# Altium schematic sheet CellMonitor1.SchDoc
size A2
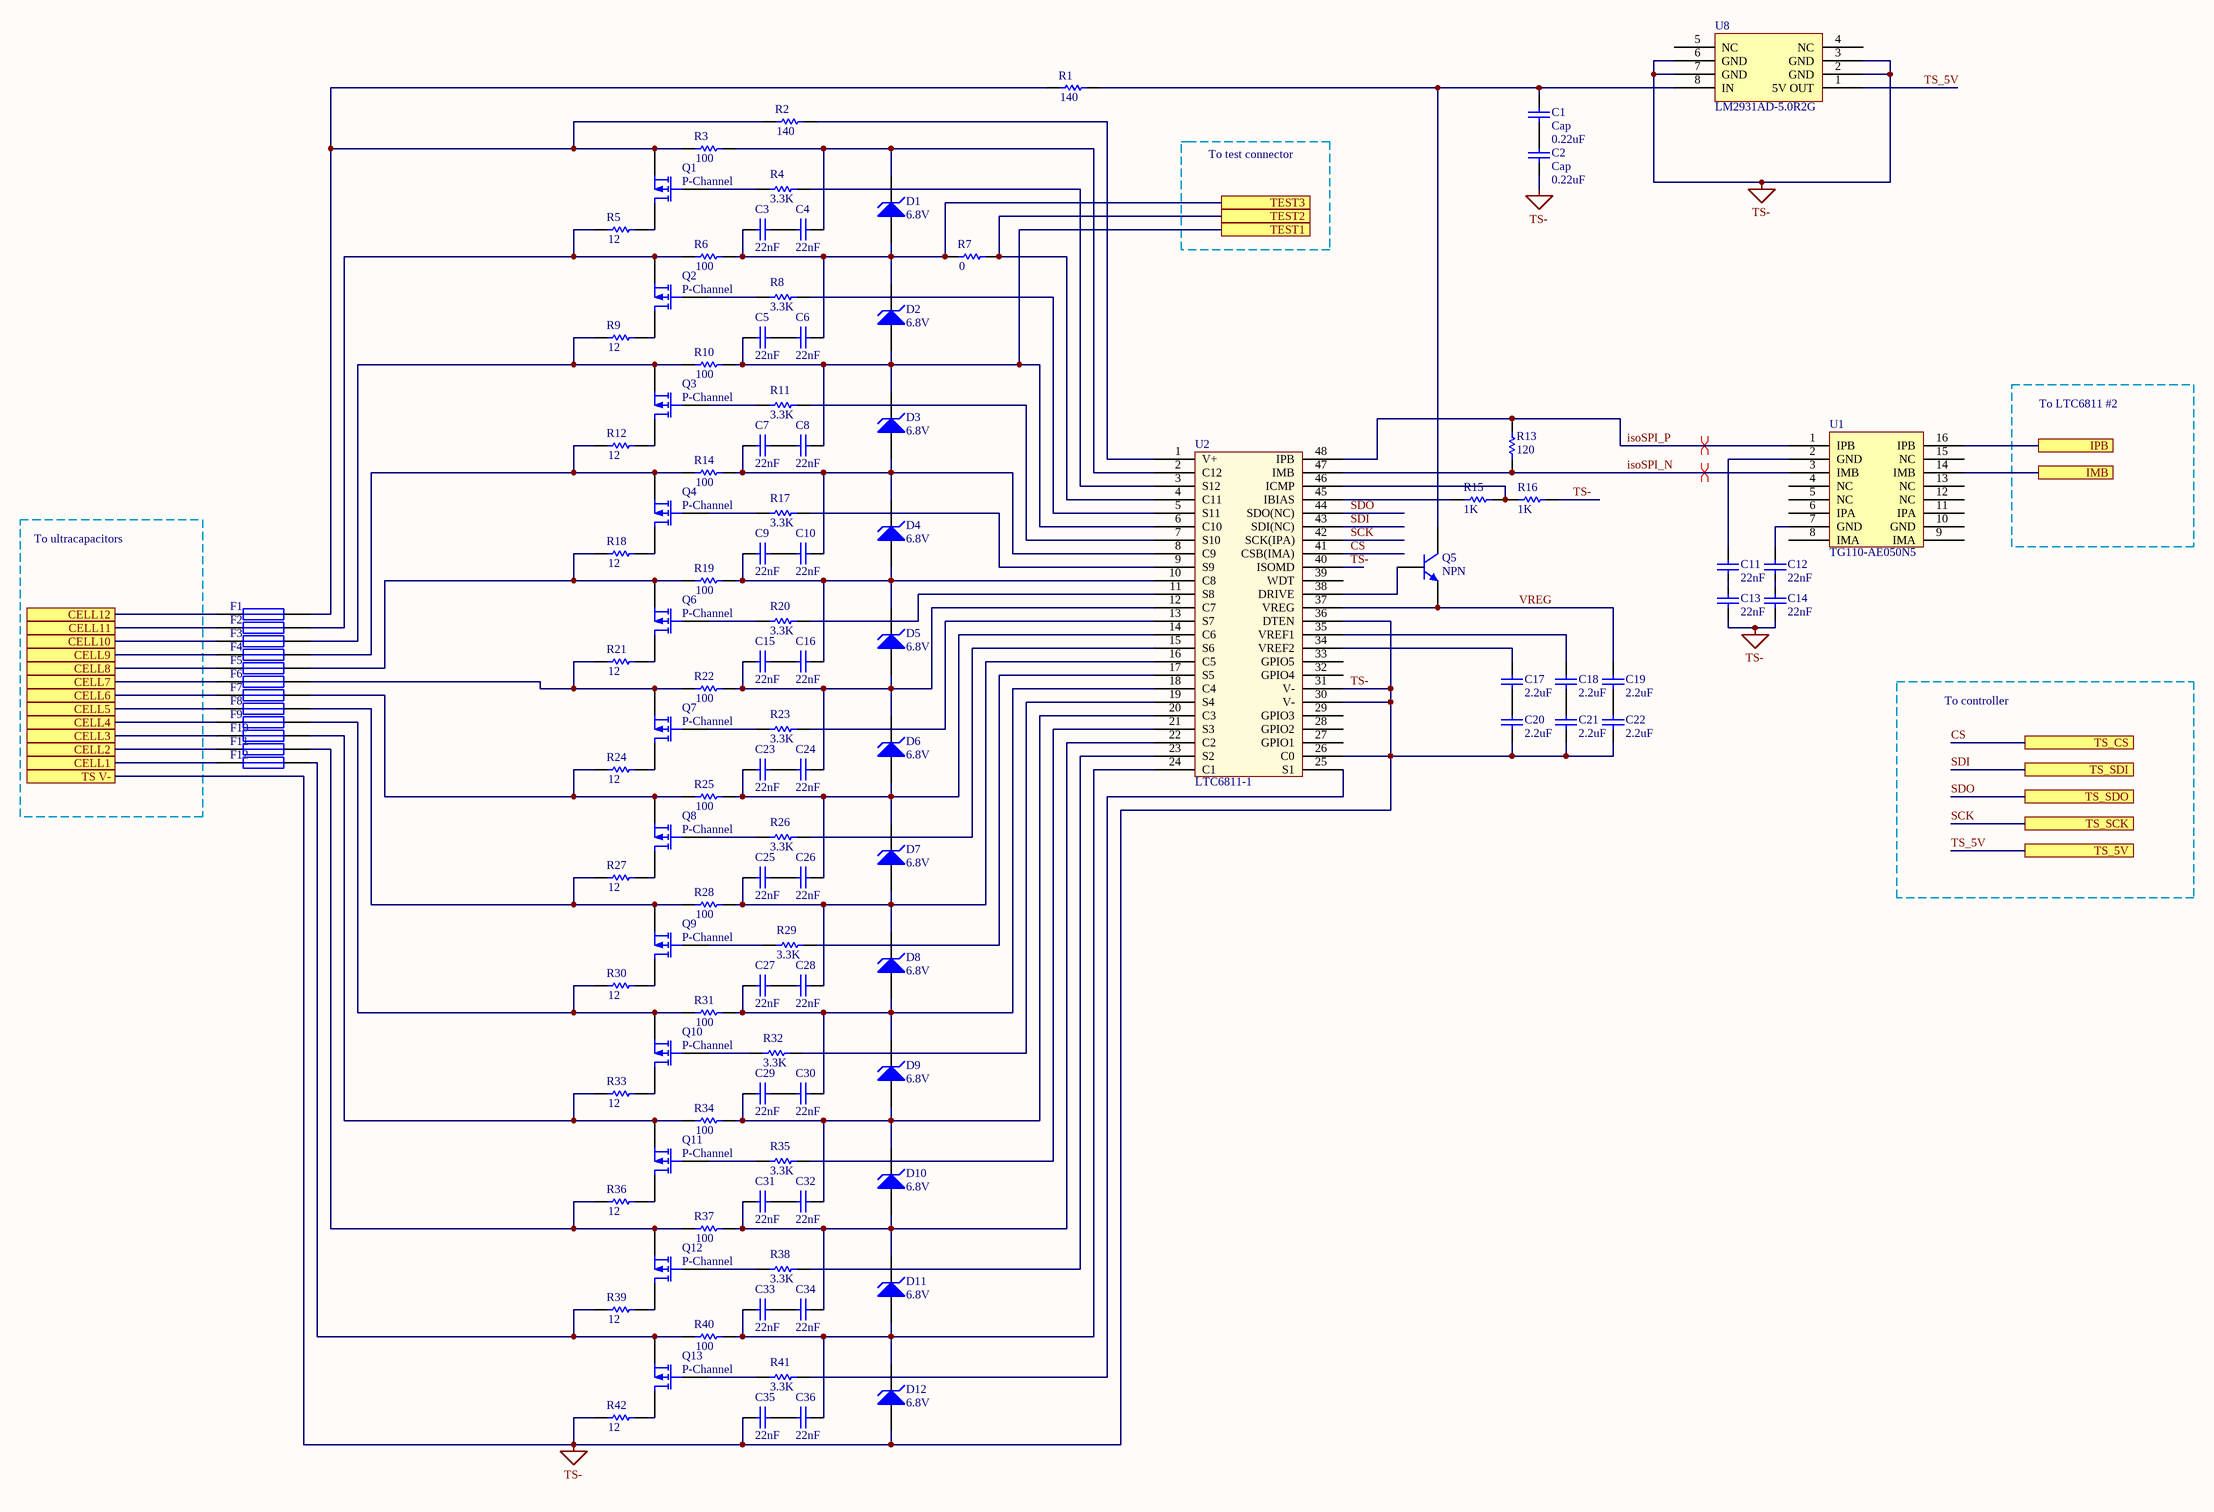
[diagram p0: CellMonitor1.SchDoc]

## Parts
C1  Cap  value 0.22uF  [0603 IMPERIAL]
C2  Cap  value 0.22uF  [0603 IMPERIAL]
C3  value 22nF  [0603 IMPERIAL]  (hidden comment: Cap)
C4  value 22nF  [0603 IMPERIAL]  (hidden comment: Cap)
C5  value 22nF  [0603 IMPERIAL]  (hidden comment: Cap)
C6  value 22nF  [0603 IMPERIAL]  (hidden comment: Cap)
C7  value 22nF  [0603 IMPERIAL]  (hidden comment: Cap)
C8  value 22nF  [0603 IMPERIAL]  (hidden comment: Cap)
C9  value 22nF  [0603 IMPERIAL]  (hidden comment: Cap)
C10  value 22nF  [0603 IMPERIAL]  (hidden comment: Cap)
C11  value 22nF  [0603 IMPERIAL]  (hidden comment: Cap)
C12  value 22nF  [0603 IMPERIAL]  (hidden comment: Cap)
C13  value 22nF  [0603 IMPERIAL]  (hidden comment: Cap)
C14  value 22nF  [0603 IMPERIAL]  (hidden comment: Cap)
C15  value 22nF  [0603 IMPERIAL]  (hidden comment: Cap)
C16  value 22nF  [0603 IMPERIAL]  (hidden comment: Cap)
C17  value 2.2uF  [0603 IMPERIAL]  (hidden comment: Cap)
C18  value 2.2uF  [0603 IMPERIAL]  (hidden comment: Cap)
C19  value 2.2uF  [0603 IMPERIAL]  (hidden comment: Cap)
C20  value 2.2uF  [0603 IMPERIAL]  (hidden comment: Cap)
C21  value 2.2uF  [0603 IMPERIAL]  (hidden comment: Cap)
C22  value 2.2uF  [0603 IMPERIAL]  (hidden comment: Cap)
C23  value 22nF  [0603 IMPERIAL]  (hidden comment: Cap)
C24  value 22nF  [0603 IMPERIAL]  (hidden comment: Cap)
C25  value 22nF  [0603 IMPERIAL]  (hidden comment: Cap)
C26  value 22nF  [0603 IMPERIAL]  (hidden comment: Cap)
C27  value 22nF  [0603 IMPERIAL]  (hidden comment: Cap)
C28  value 22nF  [0603 IMPERIAL]  (hidden comment: Cap)
C29  value 22nF  [0603 IMPERIAL]  (hidden comment: Cap)
C30  value 22nF  [0603 IMPERIAL]  (hidden comment: Cap)
C31  value 22nF  [0603 IMPERIAL]  (hidden comment: Cap)
C32  value 22nF  [0603 IMPERIAL]  (hidden comment: Cap)
C33  value 22nF  [0603 IMPERIAL]  (hidden comment: Cap)
C34  value 22nF  [0603 IMPERIAL]  (hidden comment: Cap)
C35  value 22nF  [0603 IMPERIAL]  (hidden comment: Cap)
C36  value 22nF  [0603 IMPERIAL]  (hidden comment: Cap)
D1  6.8V  [SOD-323]
D2  6.8V  [SOD-323]
D3  6.8V  [SOD-323]
D4  6.8V  [SOD-323]
D5  6.8V  [SOD-323]
D6  6.8V  [SOD-323]
D7  6.8V  [SOD-323]
D8  6.8V  [SOD-323]
D9  6.8V  [SOD-323]
D10  6.8V  [SOD-323]
D11  6.8V  [SOD-323]
D12  6.8V  [SOD-323]
F1  0451.500NRL  [0451.500NRL]  (value not drawn)
F2  0451.500NRL  [0451.500NRL]  (value not drawn)
F3  0451.500NRL  [0451.500NRL]  (value not drawn)
F4  0451.500NRL  [0451.500NRL]  (value not drawn)
F5  0451.500NRL  [0451.500NRL]  (value not drawn)
F6  0451.500NRL  [0451.500NRL]  (value not drawn)
F7  0451.500NRL  [0451.500NRL]  (value not drawn)
F8  0451.500NRL  [0451.500NRL]  (value not drawn)
F9  0451.500NRL  [0451.500NRL]  (value not drawn)
F10  0451.500NRL  [0451.500NRL]  (value not drawn)
F11  0451.500NRL  [0451.500NRL]  (value not drawn)
F12  0451.500NRL  [0451.500NRL]  (value not drawn)
Q1  P-Channel  [SOT23F]
Q2  P-Channel  [SOT23F]
Q3  P-Channel  [SOT23F]
Q4  P-Channel  [SOT23F]
Q5  NPN  [SOT223_N]
Q6  P-Channel  [SOT23F]
Q7  P-Channel  [SOT23F]
Q8  P-Channel  [SOT23F]
Q9  P-Channel  [SOT23F]
Q10  P-Channel  [SOT23F]
Q11  P-Channel  [SOT23F]
Q12  P-Channel  [SOT23F]
Q13  P-Channel  [SOT23F]
R1  value 140  [0603 IMPERIAL]  (hidden comment: Res1)
R2  value 140  [0603 IMPERIAL]  (hidden comment: Res1)
R3  value 100  [0603 IMPERIAL]  (hidden comment: Res1)
R4  value 3.3K  [0603 IMPERIAL]  (hidden comment: Res1)
R5  value 12  [2512 IMPERIAL]  (hidden comment: Res1)
R6  value 100  [0603 IMPERIAL]  (hidden comment: Res1)
R7  value 0  [0603 IMPERIAL]  (hidden comment: Res1)
R8  value 3.3K  [0603 IMPERIAL]  (hidden comment: Res1)
R9  value 12  [2512 IMPERIAL]  (hidden comment: Res1)
R10  value 100  [0603 IMPERIAL]  (hidden comment: Res1)
R11  value 3.3K  [0603 IMPERIAL]  (hidden comment: Res1)
R12  value 12  [2512 IMPERIAL]  (hidden comment: Res1)
R13  120  [0603 IMPERIAL]
R14  value 100  [0603 IMPERIAL]  (hidden comment: Res1)
R15  1K  [0603 IMPERIAL]
R16  1K  [0603 IMPERIAL]
R17  value 3.3K  [0603 IMPERIAL]  (hidden comment: Res1)
R18  value 12  [2512 IMPERIAL]  (hidden comment: Res1)
R19  value 100  [0603 IMPERIAL]  (hidden comment: Res1)
R20  value 3.3K  [0603 IMPERIAL]  (hidden comment: Res1)
R21  value 12  [2512 IMPERIAL]  (hidden comment: Res1)
R22  value 100  [0603 IMPERIAL]  (hidden comment: Res1)
R23  value 3.3K  [0603 IMPERIAL]  (hidden comment: Res1)
R24  value 12  [2512 IMPERIAL]  (hidden comment: Res1)
R25  value 100  [0603 IMPERIAL]  (hidden comment: Res1)
R26  value 3.3K  [0603 IMPERIAL]  (hidden comment: Res1)
R27  value 12  [2512 IMPERIAL]  (hidden comment: Res1)
R28  value 100  [0603 IMPERIAL]  (hidden comment: Res1)
R29  value 3.3K  [0603 IMPERIAL]  (hidden comment: Res1)
R30  value 12  [2512 IMPERIAL]  (hidden comment: Res1)
R31  value 100  [0603 IMPERIAL]  (hidden comment: Res1)
R32  value 3.3K  [0603 IMPERIAL]  (hidden comment: Res1)
R33  value 12  [2512 IMPERIAL]  (hidden comment: Res1)
R34  value 100  [0603 IMPERIAL]  (hidden comment: Res1)
R35  value 3.3K  [0603 IMPERIAL]  (hidden comment: Res1)
R36  value 12  [2512 IMPERIAL]  (hidden comment: Res1)
R37  value 100  [0603 IMPERIAL]  (hidden comment: Res1)
R38  value 3.3K  [0603 IMPERIAL]  (hidden comment: Res1)
R39  value 12  [2512 IMPERIAL]  (hidden comment: Res1)
R40  value 100  [0603 IMPERIAL]  (hidden comment: Res1)
R41  value 3.3K  [0603 IMPERIAL]  (hidden comment: Res1)
R42  value 12  [2512 IMPERIAL]  (hidden comment: Res1)
U1  TG110-AE050N5  [Halo N5]
U2  LTC6811-1  [SSOP-48]
U8  LM2931AD-5.0R2G  [8-SOIC]

## Ports
CELL1, CELL2, CELL3, CELL4, CELL5, CELL6, CELL7, CELL8, CELL9, CELL10, CELL11, CELL12, IMB, IPB, TEST1, TEST2, TEST3, TS V-, TS_5V, TS_CS, TS_SCK, TS_SDI, TS_SDO

## Nets
TS-: C2.2 C13.2 C14.2 C20.2 C21.2 C22.2 C35.2 D12.1(A) R16.2 R42.1 U2.26(C0) U2.30(V-) U2.31(V-) U2.36(DTEN) U2.40(ISOMD) U8.2(GND) U8.3(GND) U8.6(GND) U8.7(GND) ; port TS V-
CELL1: F12.1 ; port CELL1
CELL2: F11.1 ; port CELL2
CELL3: F10.1 ; port CELL3
CELL4: F9.1 ; port CELL4
CELL5: F8.1 ; port CELL5
CELL6: F7.1 ; port CELL6
CELL7: F6.1 ; port CELL7
CELL8: F5.1 ; port CELL8
CELL9: F4.1 ; port CELL9
CELL10: F3.1 ; port CELL10
CELL11: F2.1 ; port CELL11
CELL12: F1.1 ; port CELL12
CS: U2.41(CSB(IMA)) ; port TS_CS
IMB: U1.14(IMB) ; port IMB
IPB: U1.16(IPB) ; port IPB
isoSPI_N: R13.1 U1.3(IMB) U2.47(IMB)
isoSPI_P: R13.2 U1.1(IPB) U2.48(IPB)
SCK: U2.42(SCK(IPA)) ; port TS_SCK
SDI: U2.43(SDI(NC)) ; port TS_SDI
SDO: U2.44(SDO(NC)) ; port TS_SDO
TEST1: C5.2 C8.1 D2.1(A) D3.2(K) R10.2 U2.6(C10) ; port TEST1
TEST2: R7.2 U2.4(C11) ; port TEST2
TEST3: C3.2 C6.1 D1.1(A) D2.2(K) R6.2 R7.1 ; port TEST3
TS_5V: U8.1(5V_OUT) ; port TS_5V
VREG: C19.1 Q5.3(E) U2.37(VREG)
NetC1_1: C1.1 Q5.2(C) R1.2 U8.8(IN)
NetC1_2: C1.2 C2.1
NetC3_1: C3.1 C4.2
NetC4_1: C4.1 D1.2(K) R3.2 U2.2(C12)
NetC5_1: C5.1 C6.2
NetC7_1: C7.1 C8.2
NetC7_2: C7.2 C10.1 D3.1(A) D4.2(K) R14.2 U2.8(C9)
NetC9_1: C9.1 C10.2
NetC9_2: C9.2 C16.1 D4.1(A) D5.2(K) R19.2 U2.10(C8)
NetC11_1: C11.1 U1.2(GND)
NetC11_2: C11.2 C13.1
NetC12_1: C12.1 U1.7(GND)
NetC12_2: C12.2 C14.1
NetC15_1: C15.1 C16.2
NetC15_2: C15.2 C24.1 D5.1(A) D6.2(K) R22.2 U2.12(C7)
NetC17_1: C17.1 U2.34(VREF2)
NetC17_2: C17.2 C20.1
NetC18_1: C18.1 U2.35(VREF1)
NetC18_2: C18.2 C21.1
NetC19_2: C19.2 C22.1
NetC23_1: C23.1 C24.2
NetC23_2: C23.2 C26.1 D6.1(A) D7.2(K) R25.2 U2.14(C6)
NetC25_1: C25.1 C26.2
NetC25_2: C25.2 C28.1 D7.1(A) D8.2(K) R28.2 U2.16(C5)
NetC27_1: C27.1 C28.2
NetC27_2: C27.2 C30.1 D8.1(A) D9.2(K) R31.2 U2.18(C4)
NetC29_1: C29.1 C30.2
NetC29_2: C29.2 C32.1 D9.1(A) D10.2(K) R34.2 U2.20(C3)
NetC31_1: C31.1 C32.2
NetC31_2: C31.2 C34.1 D10.1(A) D11.2(K) R37.2 U2.22(C2)
NetC33_1: C33.1 C34.2
NetC33_2: C33.2 C36.1 D11.1(A) D12.2(K) R40.2 U2.24(C1)
NetC35_1: C35.1 C36.2
NetF1_2: F1.2 Q1.3(S) R1.1 R2.1 R3.1
NetF2_2: F2.2 Q2.3(S) R5.1 R6.1
NetF3_2: F3.2 Q3.3(S) R9.1 R10.1
NetF4_2: F4.2 Q4.3(S) R12.1 R14.1
NetF5_2: F5.2 Q6.3(S) R18.1 R19.1
NetF6_2: F6.2 Q7.3(S) R21.1 R22.1
NetF7_2: F7.2 Q8.3(S) R24.1 R25.1
NetF8_2: F8.2 Q9.3(S) R27.1 R28.1
NetF9_2: F9.2 Q10.3(S) R30.1 R31.1
NetF10_2: F10.2 Q11.3(S) R33.1 R34.1
NetF11_2: F11.2 Q12.3(S) R36.1 R37.1
NetF12_2: F12.2 Q13.3(S) R39.1 R40.1
NetQ1_1: Q1.1(D) R5.2
NetQ1_2: Q1.2(G) R4.1
NetQ2_1: Q2.1(D) R9.2
NetQ2_2: Q2.2(G) R8.1
NetQ3_1: Q3.1(D) R12.2
NetQ3_2: Q3.2(G) R11.1
NetQ4_1: Q4.1(D) R18.2
NetQ4_2: Q4.2(G) R17.1
NetQ5_1: Q5.1(B) U2.38(DRIVE)
NetQ6_1: Q6.1(D) R21.2
NetQ6_2: Q6.2(G) R20.1
NetQ7_1: Q7.1(D) R24.2
NetQ7_2: Q7.2(G) R23.1
NetQ8_1: Q8.1(D) R27.2
NetQ8_2: Q8.2(G) R26.1
NetQ9_1: Q9.1(D) R30.2
NetQ9_2: Q9.2(G) R29.1
NetQ10_1: Q10.1(D) R33.2
NetQ10_2: Q10.2(G) R32.1
NetQ11_1: Q11.1(D) R36.2
NetQ11_2: Q11.2(G) R35.1
NetQ12_1: Q12.1(D) R39.2
NetQ12_2: Q12.2(G) R38.1
NetQ13_1: Q13.1(D) R42.2
NetQ13_2: Q13.2(G) R41.1
NetR2_2: R2.2 U2.1(V+)
NetR4_2: R4.2 U2.3(S12)
NetR8_2: R8.2 U2.5(S11)
NetR11_2: R11.2 U2.7(S10)
NetR15_1: R15.1 U2.45(IBIAS)
NetR15_2: R15.2 R16.1 U2.46(ICMP)
NetR17_2: R17.2 U2.9(S9)
NetR20_2: R20.2 U2.11(S8)
NetR23_2: R23.2 U2.13(S7)
NetR26_2: R26.2 U2.15(S6)
NetR29_2: R29.2 U2.17(S5)
NetR32_2: R32.2 U2.19(S4)
NetR35_2: R35.2 U2.21(S3)
NetR38_2: R38.2 U2.23(S2)
NetR41_2: R41.2 U2.25(S1)

Not connected (* = marked no-connect by the designer): U1 4(NC) 5(NC) 6(IPA) 8(IMA) 9(IMA) 10(GND) 11(IPA) 12(NC) 13(NC) 15(NC); U2 27(GPIO1) 28(GPIO2) 29(GPIO3) 32(GPIO4) 33(GPIO5) 39(WDT); U8 4(NC) 5(NC)

## Layout directives
differential pair: isoSPI_N, isoSPI_P

## Notes on the sheet
- To test connector
- To LTC6811 #2
- To ultracapacitors
- To controller
- Document name:
- Project name:
- Date:
- Time:
- Drawn by:
- Validation
- Sheet
- University of Victoria
- 3800 Finnerty Road
- Victoria BC V8P 5C2
- CANADA
- of
- Revision:
- Size:
- A2

## Library data of the parts
C1-C36 = Cap: Capacitor; Published: 8-Jun-2000; LatestRevisionDate: 17-Jul-2002; LatestRevisionNote: Re-released for DXP Platform.; PackageReference: RAD-0.3; Publisher: Altium Limited; PackageDescription: Radial Cap, Thru-Hole; 2 Leads; 0.3 in Pin Spacing
  C1 C2: Supplier Part Number: 490-5402-1-ND
  C3-C16 C23-C36: Supplier Part Number: 399-3476-1-ND
  C17-C22: Supplier Part Number: 490-3296-1-ND
D1-D12 = D Zener: Zener Diode; Published: 8-Jun-2000; LatestRevisionDate: 17-Jul-2002; LatestRevisionNote: Re-released for DXP Platform.; PackageReference: DIODE-0.7; Publisher: Altium Limited; PackageDescription: Diode, Thru-Hole; 2 Leads; 0.7 in Pin Spacing; Supplier Part Number: 568-6455-1-ND
F1-F12 = Fuse 1: Fuse; Published: 8-Jun-2000; LatestRevisionDate: 17-Jul-2002; LatestRevisionNote: Re-released for DXP Platform.; PackageReference: PIN-W2/E2.8; Publisher: Altium Limited
  F1 F2 F5-F9 F11: Supplier Part Number: F5964CT-ND
Q1-Q4 Q6-Q13 = MOSFET-P: P-Channel MOSFET; Published: 8-Jun-2000; LatestRevisionDate: 17-Jul-2002; LatestRevisionNote: Re-released for DXP Platform.; PackageVersion: 1995/1996; PackageReference: E3; Publisher: Altium Limited; PackageDescription: TO, Flat Index; 3 In-Line, Axial Leads; Body Dia. 4.6mm; Lead Dia. 0.5 mm (max); Supplier Part Number: BSS308PE H6327CT-ND
Q5 = 2N3904: NPN General Purpose Amplifier; Published: 8-Jun-2000; LatestRevisionDate: 15-Jan-2003; LatestRevisionNote: PCB Footprint 'BCY-W3/D4.7' replaced; DatasheetVersion: 1997; PackageVersion: Sep-1998; PackageReference: TO-92A; Publisher: Altium Limited; PackageDescription: TO, Flat Index; 3 In-Line, Axial Leads; Body Dia. 4.5mm; Leads 0.51 x 0.48 mm (max); ComponentLink1Description: Manufacturer Link; ComponentLink1URL: http://www.fairchildsemi.com/; ComponentLink2Description: Datasheet; ComponentLink2URL: http://www.fairchildsemi.com/ds/2N%2F2N3904.pdf; Supplier Part Number: NSV1C201MZ4T1GOSCT-ND
R1-R42 = Res1: Resistor
  R1 R2: Published: 8-Jun-2000; LatestRevisionDate: 17-Jul-2002; LatestRevisionNote: Re-released for DXP Platform.; PackageReference: AXIAL-0.3; Publisher: Altium Limited; PackageDescription: Axial Device, Thru-Hole; 2 Leads; 0.3 in Pin Spacing; Supplier Part Number: P140HCT-ND
  R3 R6 R10 R14 R19 R22 R25 R28 R31 R34 R37 R40: Published: 8-Jun-2000; LatestRevisionDate: 17-Jul-2002; LatestRevisionNote: Re-released for DXP Platform.; PackageReference: AXIAL-0.3; Publisher: Altium Limited; PackageDescription: Axial Device, Thru-Hole; 2 Leads; 0.3 in Pin Spacing; Supplier Part Number: 311-100HRCT-ND
  R4 R8 R11 R17 R20 R23 R26 R29 R32 R35 R38 R41: Published: 8-Jun-2000; LatestRevisionDate: 17-Jul-2002; LatestRevisionNote: Re-released for DXP Platform.; PackageReference: AXIAL-0.3; Publisher: Altium Limited; PackageDescription: Axial Device, Thru-Hole; 2 Leads; 0.3 in Pin Spacing; Supplier Part Number: 311-3.30KHRCT-ND
  R5 R9 R12 R18 R21 R24 R27 R30 R33 R36 R39 R42: Published: 8-Jun-2000; LatestRevisionDate: 17-Jul-2002; LatestRevisionNote: Re-released for DXP Platform.; PackageReference: AXIAL-0.3; Publisher: Altium Limited; PackageDescription: Axial Device, Thru-Hole; 2 Leads; 0.3 in Pin Spacing; Supplier Part Number: RMCF2512FT12R0CT-ND
  R7: Published: 8-Jun-2000; LatestRevisionDate: 17-Jul-2002; LatestRevisionNote: Re-released for DXP Platform.; PackageReference: AXIAL-0.3; Publisher: Altium Limited; PackageDescription: Axial Device, Thru-Hole; 2 Leads; 0.3 in Pin Spacing; Supplier Part Number: 311-0.0JRTR-ND
  R13: Value: 120; Supplier Part Number: 311-120HRCT-ND
  R15 R16: Published: 8-Jun-2000; LatestRevisionDate: 17-Jul-2002; LatestRevisionNote: Re-released for DXP Platform.; PackageReference: AXIAL-0.3; Publisher: Altium Limited; PackageDescription: Axial Device, Thru-Hole; 2 Leads; 0.3 in Pin Spacing; Value: 1K; Supplier Part Number: 311-1.0KGRCT-ND
U8 = LM2931AD-5.0R2G: IC REG LINEAR 5V 100MA 8SOIC; Supplier Part Number: LM2931AD-5.0R2GOSCT-ND
U1 = TG110-AE050N5: Mouser Part Number: TG110-AE050N5